# EAGLE design encoder_tle_tiny (EAGLE 9.6.2)
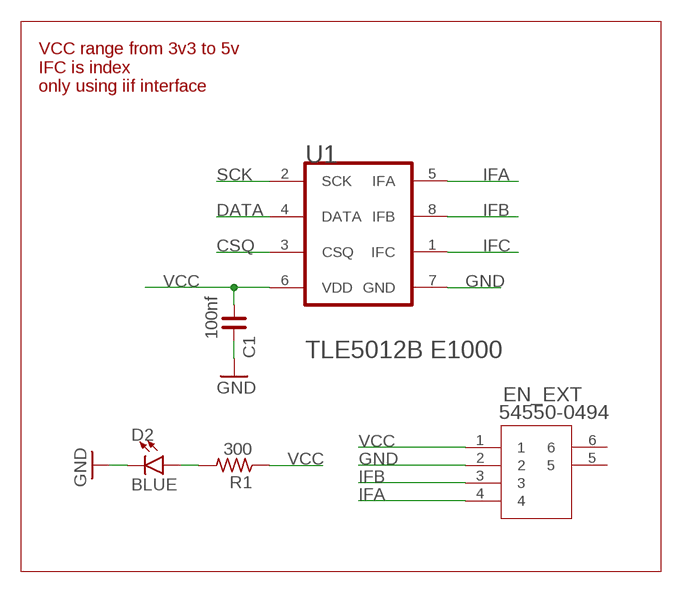
[diagram p0: schematic, sheet 1]

## Parts
C1  100nf  C_0603  [C0603]
D2  BLUE  LED-BLUE0603  [LED-0603]
EN_EXT  54550-0494  [CON4_1X4_DRB2_MOL]
R1  300  R_0603  [R0603]
U1  INFINEON_TLE5012B_E1000INFINEON_TLE5012B_E1000_0_1  [INFINEON_TLE5012B_E1000_1]

## Nets
CSQ: U1.3(CSQ)
DATA: U1.4(DATA)
GND: C1.2 D2.C EN_EXT.2 U1.7(GND)
IFA: EN_EXT.4 U1.5(IFA)
IFB: EN_EXT.3 U1.8(IFB)
IFC: U1.1(IFC)
N$2: D2.A R1.2
SCK: U1.2(SCK)
VCC: C1.1 EN_EXT.1 R1.1 U1.6(VDD)
Unconnected: EN_EXT.5 EN_EXT.6

## Notes on the sheet
- VCC range from 3v3 to 5v
  IFC is index
  only using iif interface

## Library data of the parts
C1 = rc-master-smd:C_: NON-POLARIZED CAP
D2 = SparkFun-LED:LED-BLUE: Blue SMD LED Used in manufacturing of various products at SparkFun Packages: 0603 - SMD 0603 package [Product Link] <http://www.digikey.com/product-detail/en/SMLE12BC7TT86/511-1589-2-ND/1641808> 1206 - SMD1206 package [Product Link] <http://www.digikey.com/product-detail/en/lite-on-inc/LTST-C150TBKT/160-1643-1-ND/573584> SparkFun Products: ESP8266 Thing-Dev Board <https://www.sparkfun.com/products/13711> RedBoard <https://www.sparkfun.com/products/12757>; PROD_ID: DIO-08575
EN_EXT = fpc_4p_0.5:54550-0494; BUILT_BY: EMA_UL_Team; MANUFACTURER_PART_NUMBER: 54550-0494; SOURCELIBRARY: Molex_2010-01-01; VENDOR: Molex Connector Corporation
R1 = rc-master-smd:R_: RESISTOR
U1 = Infineon - TLE5012B E1000:INFINEON_TLE5012B_E1000: INF-TLE5012BEXX-PG-DSO-8; CIIVA_IDS: 7675067; COMPONENT_LINK_1_DESCRIPTION: Manufacturer URL; COMPONENT_LINK_1_URL: http://www.infineon.com/; COMPONENT_LINK_3_DESCRIPTION: Package Specification; COMPONENT_LINK_3_URL: http://www.infineon.com/dgdl/TLE7259-2GE_DS_rev12.pdf?folderId=db3a3043163797a6011666d32a0c0de1&fileId=db3a3043163797a6011666d4dbb80de2&location=en.Products.Automotive_ICs.Automotive_Transceivers.LIN_Transceivers.DATASHEET.TLE7259-2GE_DS_rev12.pdf; DATASHEET: http://www.infineon.com/dgdl/TLE5012B_FDS_Rev1+1.pdf?folderId=db3a30431ce5fb52011d3dd6e8012582&fileId=db3a304334fac4c601350f31c43c433f; DATASHEET_VERSION: Rev. 1.1; FOOTPRINT_VARIANT_NAME_0: Level C; FOOTPRINT_VARIANT_NAME_1: Level B; FOOTPRINT_VARIANT_NAME_2: Level A; GREEN: true; HALOGEN_FREE: available; IMPORTED: yes; IMPORTED_FROM: vault; IMPORT_TS: 1521845141; INTERFACE: SPI, IIF; MF: Infineon; MOUNTING_TECHNOLOGY: Surface Mount; MPN: TLE5012B E1000; PACKAGE: PG-DSO-8-16; PACKAGE_DESCRIPTION: 8-Pin Plastic (Green) Dual Small Outline Package, 4.9 x 3.9 mm Body, 1.27 mm Pitch; PACKAGE_VERSION: Mar-07; PACKING: Reel; PIN_0_0_1_INSIDE_EDGE: clock; PREFIX: U; RELEASE_DATE: 1409234812; VAULT_GUID: 0753320D-5F07-4E61-B6F4-8D26939B768A; VAULT_REVISION: 3B46AF6C-B76E-4A0E-8D2A-8CD1C2A5AA45

## Board
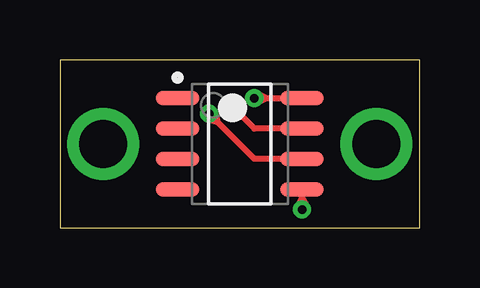
[diagram p1: board, top side]
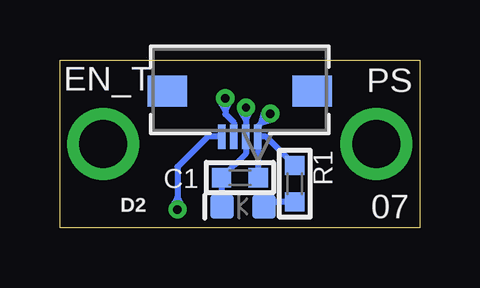
[diagram p2: board, bottom side, seen from below]

Size 15 x 7 mm. Coordinates in mm from the lower left corner, seen from the top.
Outline: 0,0 15,0 15,7 0,7 0,0
Copper layers (1*16): Top 0.035mm / dielectric 1.5mm / Bottom 0.035mm
Design rules "default *": minimum track width 3mil, minimum drill 0.35mm, track to track 3mil, track to pad 3mil, pad to pad 3mil, via to via 3mil, smd to smd 3mil, copper to edge 3mil, drill to drill 3mil, minimum pad ring 10mil, minimum via ring 8mil, stop-mask expansion 4mil, vias tented up to drill 20mil, thermal gap 10mil

### Footprints (pad centres in the part's own frame; a part is rotated, then mirrored left to right if it is on the bottom)
C0603 = smd 0.8 x 0.8: 1 -0.762,0; 2 0.762,0
LED-0603 = smd 1 x 1: A -0.877,0; C 0.877,0
CON4_1X4_DRB2_MOL = smd 0.305 x 1.016: 1 0.75,-1.702; 2 0.25,-1.702; 3 -0.25,-1.702; 4 -0.75,-1.702 | smd 1.65 x 1.3: 5 -3.023,0.203; 6 3.023,0.203
R0603 = smd 0.8 x 0.8: 1 -0.762,0; 2 0.762,0
INFINEON_TLE5012B_E1000_1 = smd 1.8 x 0.6: 1 -2.6,1.905; 2 -2.6,0.635; 3 -2.6,-0.635; 4 -2.6,-1.905; 5 2.6,-1.905; 6 2.6,-0.635; 7 2.6,0.635; 8 2.6,1.905

### Placement (x,y rotation side)
C1  7.49,2.09 180 bottom
D2  7.37,0.88 180 bottom
EN_EXT  7.5,5.5 0 bottom
R1  5.21,1.83 270 bottom
U1  7.5,3.5 0 top

### Tracks (layer width: path | path; a pad name or v marks a point on that pad's centre or on a via)
GND  (via drill 0.35)
  Top 0.254: U1.7 8.11,4.13 7.61,4.64 | 7.61,4.64 v7.24,5.01 | 7.61,4.64 7.48,5.08 v7.24,5.01 | 7.61,4.64 7.17,4.77 v7.24,5.01
  Bottom 0.254: D2.C 8.24,2.08 C1.2 7.25,3.09 EN_EXT.2 7.25,4.48 | v7.24,5.01 7.25,5 7.25,4.48 | 7.25,4.48 7.46,4.89 v7.24,5.01 | 7.25,4.48 7.02,4.88 v7.24,5.01
IFA  (via drill 0.35)
  Top 0.254: v10.1,0.75 10.1,1.28 | 10.1,1.28 U1.5 | 10.1,1.28 9.88,0.87 v10.1,0.75 | 10.1,1.28 10.32,0.87 v10.1,0.75
  Bottom 0.254: EN_EXT.4 8.83,3.8 10.1,2.53 10.1,1.28 | 10.1,1.28 v10.1,0.75 | 10.1,1.28 9.88,0.87 v10.1,0.75 | 10.1,1.28 10.32,0.87 v10.1,0.75
IFB  (via drill 0.35)
  Top 0.254: v8.1,5.4 v8.11,5.41 8.63,5.41 | 8.63,5.41 U1.8 | 8.63,5.41 8.22,5.62 v8.1,5.4 | 8.63,5.41 8.22,5.18 v8.1,5.4
  Bottom 0.254: v8.1,5.4 8.1,4.88 | 8.1,4.88 8.1,4.73 7.75,4.38 EN_EXT.3 | 8.1,4.88 8.32,5.28 v8.1,5.4 | 8.1,4.88 7.88,5.28 v8.1,5.4
N$1  (via drill 2)
  other vias: 1.8,3.5
N$2
  Bottom 0.254: R1.2 6.03,1.07 6.22,0.88 D2.A
N$3  (via drill 2)
  other vias: 13.2,3.5
VCC  (via drill 0.35)
  Top 0.254: U1.6 8.11,2.87 6.59,4.38 | 6.59,4.38 v6.22,4.75 | 6.59,4.38 6.46,4.83 v6.22,4.75 | 6.59,4.38 6.15,4.51 v6.22,4.75
  Bottom 0.254: EN_EXT.1 6.75,2.11 C1.1 | R1.1 6.41,3.8 EN_EXT.1 | v6.22,4.75 6.59,4.38 | 6.59,4.38 6.75,4.23 EN_EXT.1 | 6.59,4.38 6.46,4.83 v6.22,4.75 | 6.59,4.38 6.15,4.51 v6.22,4.75

### Text on the board
bPlace: PS | EN_T | 07